# EAGLE schematic TG3 (EAGLE 7.7.0)
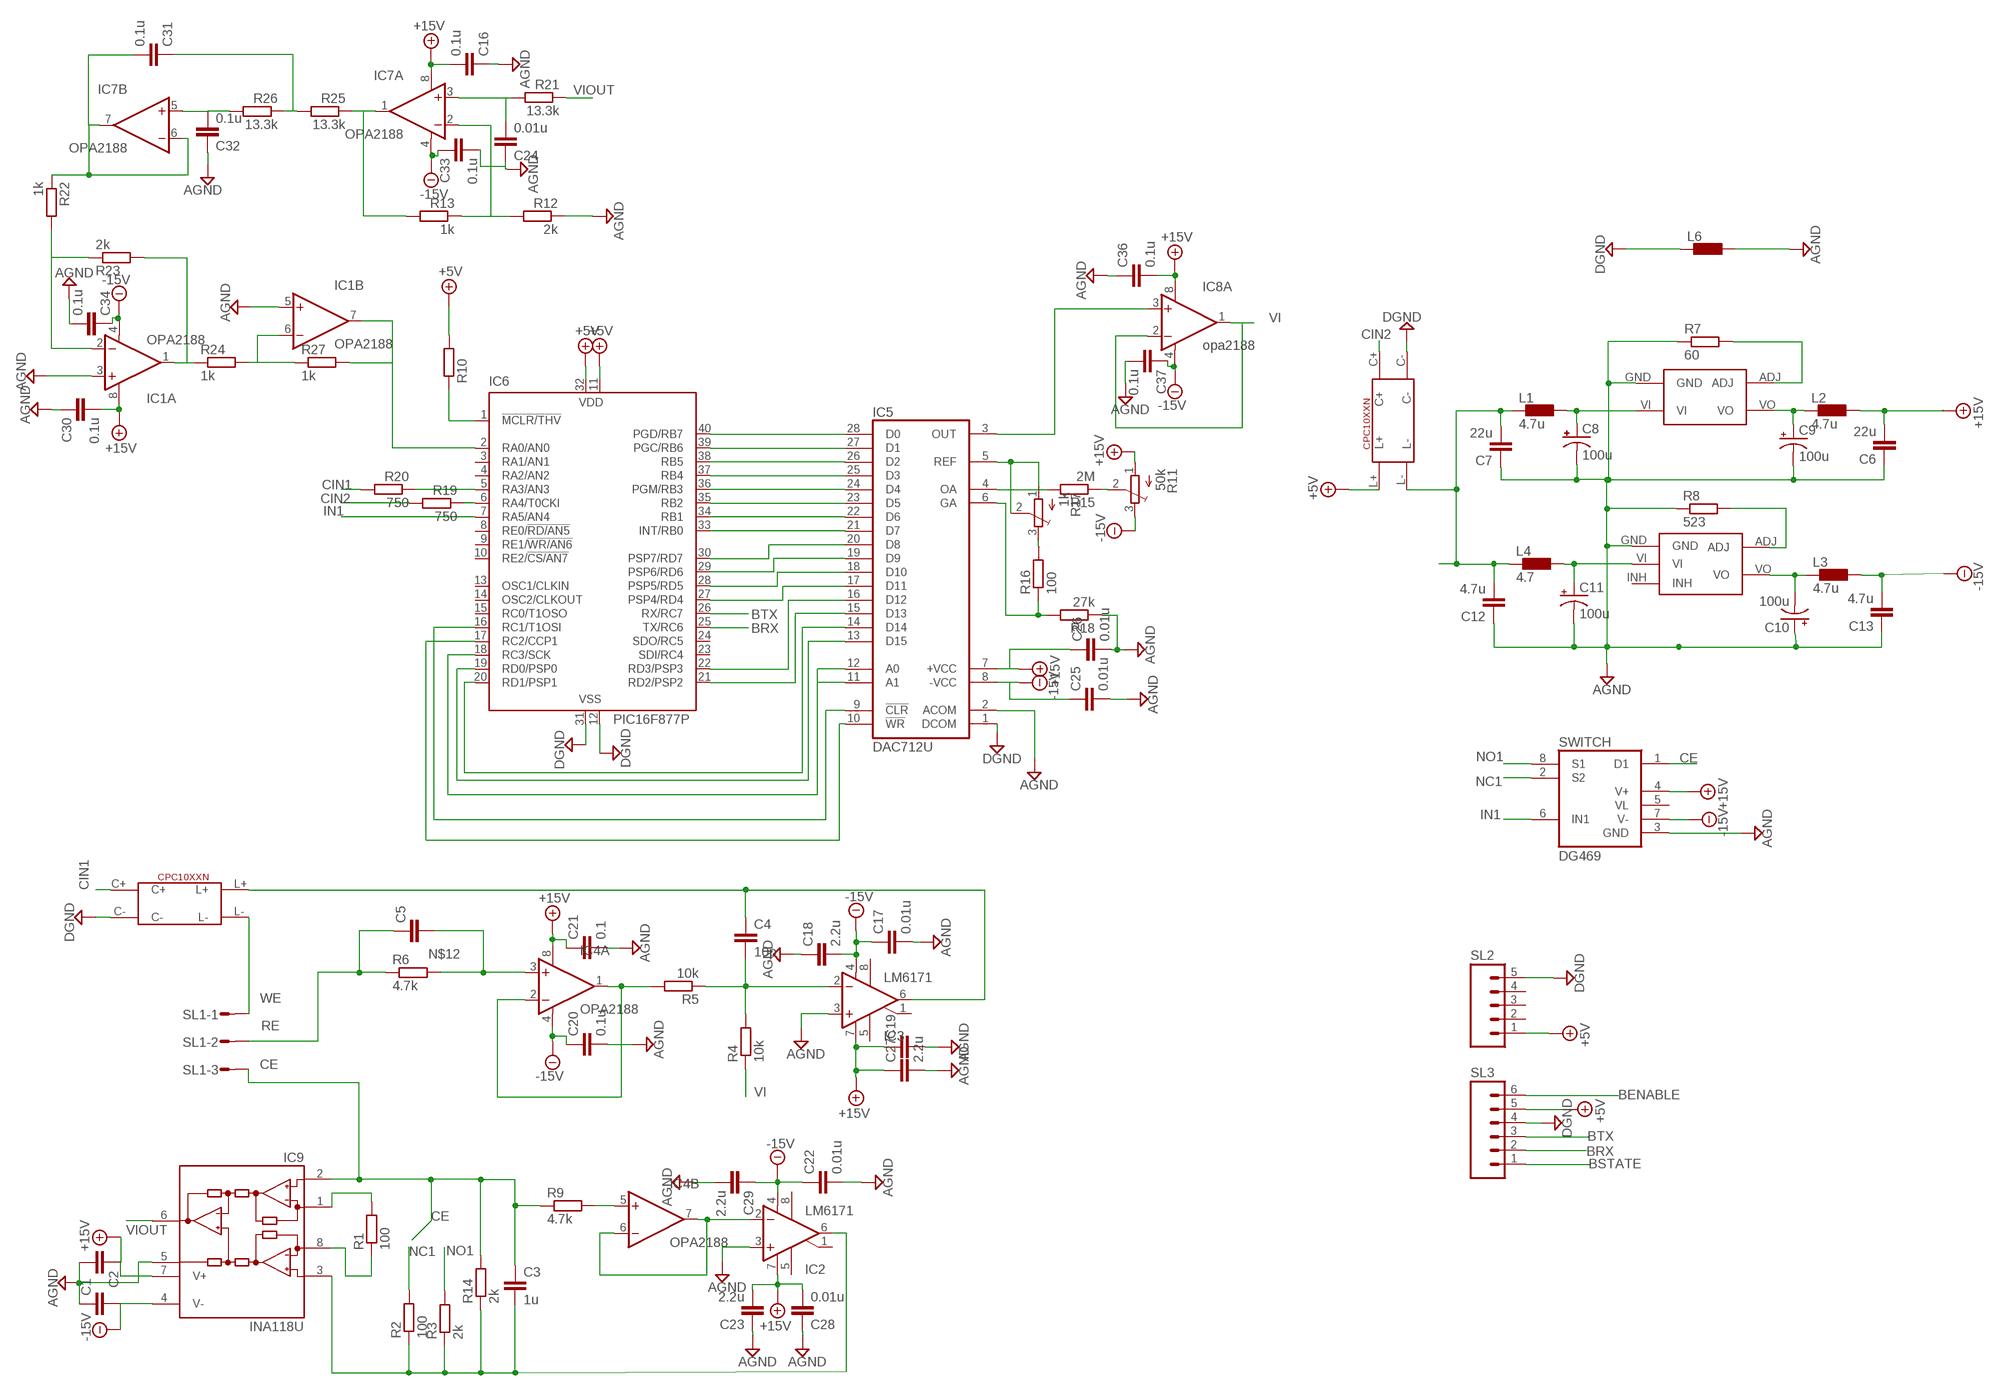
[diagram p0: schematic, sheet 1]

## Parts
C1  C  [C0805]
C2  C  [C0805]
C3  1u  C  [C0805]
C4  10p  C  [C0805]
C5  C  [C0805]
C6  22u  C  [C0805]
C7  22u  C  [C0805]
C8  100u  CPOL-US150CLZ-0810  [150CLZ-0810]
C9  100u  CPOL-US150CLZ-0810  [150CLZ-0810]
C10  100u  CPOL-US150CLZ-0810  [150CLZ-0810]
C11  100u  CPOL-US150CLZ-0810  [150CLZ-0810]
C12  4.7u  C  [C0805]
C13  4.7u  C  [C0805]
C16  0.1u  C  [C0805]
C17  0.01u  C  [C0805]
C18  2.2u  C  [C0805]
C19  C  [C0805]
C20  0.1u  C  [C0805]
C21  0.1  C  [C0805]
C22  0.01u  C  [C0805]
C23  2.2u  C  [C0805]
C24  0.01u  C  [C0805]
C25  0.01u  C  [C0805]
C26  0.01u  C  [C0805]
C27  2.2u  C  [C0805]
C28  0.01u  C  [C0805]
C29  2.2u  C  [C0805]
C30  0.1u  C  [C0805]
C31  0.1u  C  [C0805]
C32  0.1u  C  [C0805]
C33  0.1u  C  [C0805]
C34  0.1u  C  [C0805]
C36  0.1u  C  [C0805]
C37  0.1u  C  [C0805]
IC1  OPA2188  OPA2134U  [SO08]
IC2  LM6171  LM748D  [SO08]
IC3  LM6171  LM748D  [SO08]
IC4  OPA2188  OPA2134U  [SO08]
IC5  DAC712U  [SO28-3]
IC6  PIC16F877P  [DIL40]
IC7  OPA2188  OPA2134U  [SO08]
IC8  opa2188  OPA2134U  [SO08]
IC9  INA118U  [SO08]
L1  4.7u  LL2012C  [L2012C]
L2  4.7u  LL2012C  [L2012C]
L3  4.7u  LL2012C  [L2012C]
L4  4.7  LL2012C  [L2012C]
L6  LL2012C  [L2012C]
R1  100  R  [R0805]
R2  100  R  [R0805]
R3  2k  R  [R0805]
R4  10k  R  [R0805]
R5  10k  R  [R0805]
R6  4.7k  R  [R0805]
R7  60  R  [R0805]
R8  523  R  [R0805]
R9  4.7k  R  [R0805]
R10  R  [R0805]
R11  50k  TRIM_EU-3223W  [3223W]
R12  2k  R  [R0805]
R13  1k  R  [R0805]
R14  2k  R  [R0805]
R15  2M  R  [R0805]
R16  100  R  [R0805]
R17  1k  TRIM_EU-3223W  [3223W]
R18  27k  R  [R0805]
R19  750  R  [R0805]
R20  750  R  [R0805]
R21  13.3k  R  [R0805]
R22  1k  R  [R0805]
R23  2k  R  [R0805]
R24  1k  R  [R0805]
R25  13.3k  R  [R0805]
R26  13.3k  R  [R0805]
R27  1k  R  [R0805]
SL1  M03S  [03P]
SL2  M05  [05P]
SL3  M06  [06P]
SWITCH  DG469  [SO08]
U$1  PTN04050C  [PTN04050C]
U$2  PTN04050A  [PTN04050A]
U$5  CPC10XXN  [CPC10XXN]
U$6  CPC10XXN  [CPC10XXN]

## Nets
+5V: IC6.11(VDD) IC6.32(VDD) R10.2 SL2.1 SL3.5 U$6.L+
+15V: C2.1 C6.2 C16.2 C19.1 C21.1 C23.2 C26.1 C27.1 C28.2 C30.2 C36.2 IC1.8(A:V+) IC2.7(V+) IC3.7(V+) IC4.8(A:V+) IC5.7(+VCC) IC7.8(A:V+) IC8.8(A:V+) IC9.7(V+) L2.1 R11.1(A) SWITCH.4(V+)
-15V: C1.2 C13.2 C17.1 C18.2 C20.1 C22.1 C25.1 C29.1 C33.1 C34.1 C37.1 IC1.4(A:V-) IC2.4(V-) IC3.4(V-) IC4.4(A:V-) IC5.8(-VCC) IC7.4(A:V-) IC8.4(A:V-) IC9.4(V-) L3.1 R11.3(E) SWITCH.7(V-)
AGND: C1.1 C2.2 C6.1 C7.1 C8.- C9.- C10.+ C11.- C12.1 C13.1 C16.1 C17.2 C18.1 C19.2 C20.2 C21.2 C22.2 C23.1 C24.1 C25.2 C26.2 C27.2 C28.1 C29.2 C30.1 C32.1 C33.2 C34.2 C36.1 C37.2 IC1.3(A:+IN) IC1.5(B:+IN) IC2.3(+IN) IC3.3(+IN) IC5.2(ACOM) IC9.5(REF) L6.1 R7.1 R8.1 R12.1 R18.1 SWITCH.3(GND) U$1.GND U$2.GND
BENABLE: SL3.6
BRX: IC6.25(TX/RC6) SL3.2
BSTATE: SL3.1
BTX: IC6.26(RX/RC7) SL3.3
CE: C3.1 IC9.2(-IN) R14.2 SL1.3 SWITCH.1(D1)
CIN1: R20.2 U$5.C+
CIN2: R19.2 U$6.C+
DGND: IC5.1(DCOM) IC6.12(VSS) IC6.31(VSS) L6.2 SL2.5 SL3.4 U$5.C- U$6.C-
IN1: IC6.7(RA5/AN4) SWITCH.6(IN1)
N$1: IC9.8(RG) R1.1
N$2: C3.2 IC2.6(OUT) IC9.3(+IN) R2.1 R3.1 R14.1
N$3: R7.2 U$1.ADJ
N$4: IC9.1(RG) R1.2
N$5: C9.+ L2.2 U$1.VO
N$6: IC4.1(A:OUT) IC4.2(A:-IN) R5.2
N$7: C8.+ L1.1 U$1.VI
N$9: C4.2 IC3.2(-IN) R4.2 R5.1
N$11: C11.+ L4.1 U$2.VI
N$12: C5.2 IC4.3(A:+IN) R6.2
N$13: IC2.2(-IN) IC4.6(B:-IN) IC4.7(B:OUT)
N$14: IC4.5(B:+IN) R9.2
N$15: C10.- L3.2 U$2.VO
N$16: IC6.1(!MCLR/THV) R10.1
N$17: R8.2 U$2.ADJ
N$18: IC6.6(RA4/T0CKI) R19.1
N$19: IC6.5(RA3/AN3) R20.1
N$21: IC7.2(A:-IN) R12.2 R13.1
N$22: IC5.28(D0) IC6.40(PGD/RB7)
N$23: IC5.27(D1) IC6.39(PGC/RB6)
N$24: IC5.26(D2) IC6.38(RB5)
N$25: IC5.25(D3) IC6.37(RB4)
N$26: IC5.24(D4) IC6.36(PGM/RB3)
N$27: IC5.23(D5) IC6.35(RB2)
N$28: IC5.22(D6) IC6.34(RB1)
N$29: IC5.21(D7) IC6.33(INT/RB0)
N$30: IC5.20(D8) IC6.30(PSP7/RD7)
N$31: IC5.19(D9) IC6.29(PSP6/RD6)
N$32: IC5.18(D10) IC6.28(PSP5/RD5)
N$33: IC5.17(D11) IC6.27(PSP4/RD4)
N$34: IC5.16(D12) IC6.22(RD3/PSP3)
N$35: IC5.15(D13) IC6.21(RD2/PSP2)
N$36: IC5.14(D14) IC6.20(RD1/PSP1)
N$37: IC5.13(D15) IC6.19(RD0/PSP0)
N$38: IC5.11(A1) IC5.12(A0) IC6.18(RC3/SCK)
N$39: C7.2 C12.2 L1.2 L4.2 U$6.L-
N$40: IC5.9(!CLR) IC6.16(RC1/T1OSI)
N$41: IC5.10(!WR) IC6.17(RC2/CCP1)
N$42: R9.1
N$43: C31.1 R25.2 R26.1
N$44: R11.2(S) R15.1
N$45: C24.2 IC7.3(A:+IN) R21.2
N$46: IC1.2(A:-IN) R22.2 R23.1
N$47: IC5.4(OA) R15.2
N$48: IC5.5(REF) R17.1(A) R17.2(S)
N$49: R16.2 R17.3(E)
N$50: IC5.6(GA) R16.1 R18.2
N$51: C32.2 IC7.5(B:+IN) R26.2
N$52: C31.2 IC7.6(B:-IN) IC7.7(B:OUT) R22.1
N$54: IC5.3(OUT) IC8.3(A:+IN)
N$55: C4.1 IC3.6(OUT) U$5.L+
N$56: IC1.6(B:-IN) R24.2 R27.1
NC1: R2.2 SWITCH.2(S2)
NO1: R3.2 SWITCH.8(S1)
RE: C5.1 R6.1 SL1.2
VI: IC8.1(A:OUT) IC8.2(A:-IN) R4.1
VIOUT: IC9.6(OUT) R21.1
VIOUT_IN: IC7.1(A:OUT) R13.2 R25.1
VIOUT_IN1: IC1.1(A:OUT) R23.2 R24.1
VIOUT_IN2: IC1.7(B:OUT) IC6.2(RA0/AN0) R27.2
WE: SL1.1 U$5.L-
Unconnected: IC2.1(ON/CMP) IC2.5(ON) IC2.8(CMP) IC3.1(ON/CMP) IC3.5(ON) IC3.8(CMP) IC6.3(RA1/AN1) IC6.4(RA2/AN2) IC6.8(RE0/!RD/AN5) IC6.9(RE1/!WR/AN6) IC6.10(RE2/!CS/AN7) IC6.13(OSC1/CLKIN) IC6.14(OSC2/CLKOUT) IC6.15(RC0/T1OSO) IC6.23(SDI/RC4) IC6.24(SDO/RC5) IC8.5(B:+IN) IC8.6(B:-IN) IC8.7(B:OUT) SL2.2 SL2.3 SL2.4 U$2.INH

## Power pins joined to a net without a drawn wire
VL: SWITCH.5(VL)

## Library data of the parts
C1-C7 C12 C13 C16-C34 C36 C37 = eagle-ltspice:C: CAPACITOR, European symbol; SPICEMODEL: NONE; SPICEPREFIX: C
C8-C11 = resistor:CPOL-US: POLARIZED CAPACITOR, American symbol
IC1 IC4 IC7 IC8 = burr-brown:OPA2134: Operational Amplifier; MF: TEXAS INSTRUMENTS; MPN: OPA2134UA; OC_FARNELL: 1206935; OC_NEWARK: 35C1847
IC2 IC3 = linear:*748: OP AMP
IC5 = burr-brown:DAC712: 16-Bit DAC with 16-Bit Bus Interface; MF: TEXAS INSTRUMENTS; MPN: DAC712U; OC_FARNELL: 1097510; OC_NEWARK: 74C9132
IC6 = microchip:PIC16F87*: MICROCONTROLLER; MF: MICROCHIP; MPN: PIC16F877-04/P; OC_FARNELL: 9761349; OC_NEWARK: 61K3463
IC9 = burr-brown:INA118: Instrumentation Amplifier Precision, Low Power; MF: TEXAS INSTRUMENTS; MPN: INA118U; OC_FARNELL: 1212404; OC_NEWARK: 04M6168
L1-L4 L6 = eagle-ltspice:L: INDUCTOR, European symbol; SPICEMODEL: NONE; SPICEPREFIX: L
R1-R10 R12-R16 R18-R27 = eagle-ltspice:R: RESISTOR, European symbol; SPICEMODEL: NONE; SPICEPREFIX: R
R11 R17 = pot:TRIM_EU-: POTENTIOMETER
SL1 = con-amp-quick:M03S: AMP QUICK CONNECTOR; OC_FARNELL: unknown; OC_NEWARK: unknown
SL2 = con-amp-quick:M05: AMP QUICK CONNECTOR; OC_FARNELL: unknown; OC_NEWARK: unknown
SL3 = con-amp-quick:M06: AMP QUICK CONNECTOR; OC_FARNELL: unknown; OC_NEWARK: unknown
SWITCH = maxim:DG469
U$1 = Milib:PTN04050C
U$2 = Milib:PTN04050A
U$5 U$6 = Milib:CPC10XXN